# EasyEDA Pro project ProPrj_Modular Robot_2025-12-08.epro

# Schematic Schematic1
Board Name: Board1; Create Date: 2025-11-24; Page Name: P1; Project Name: Modular Robot; Schematic Name: Schematic1; Update Date: 2025-12-05; Company: EasyEDA.com; Page Size: A4; Version: V1.0
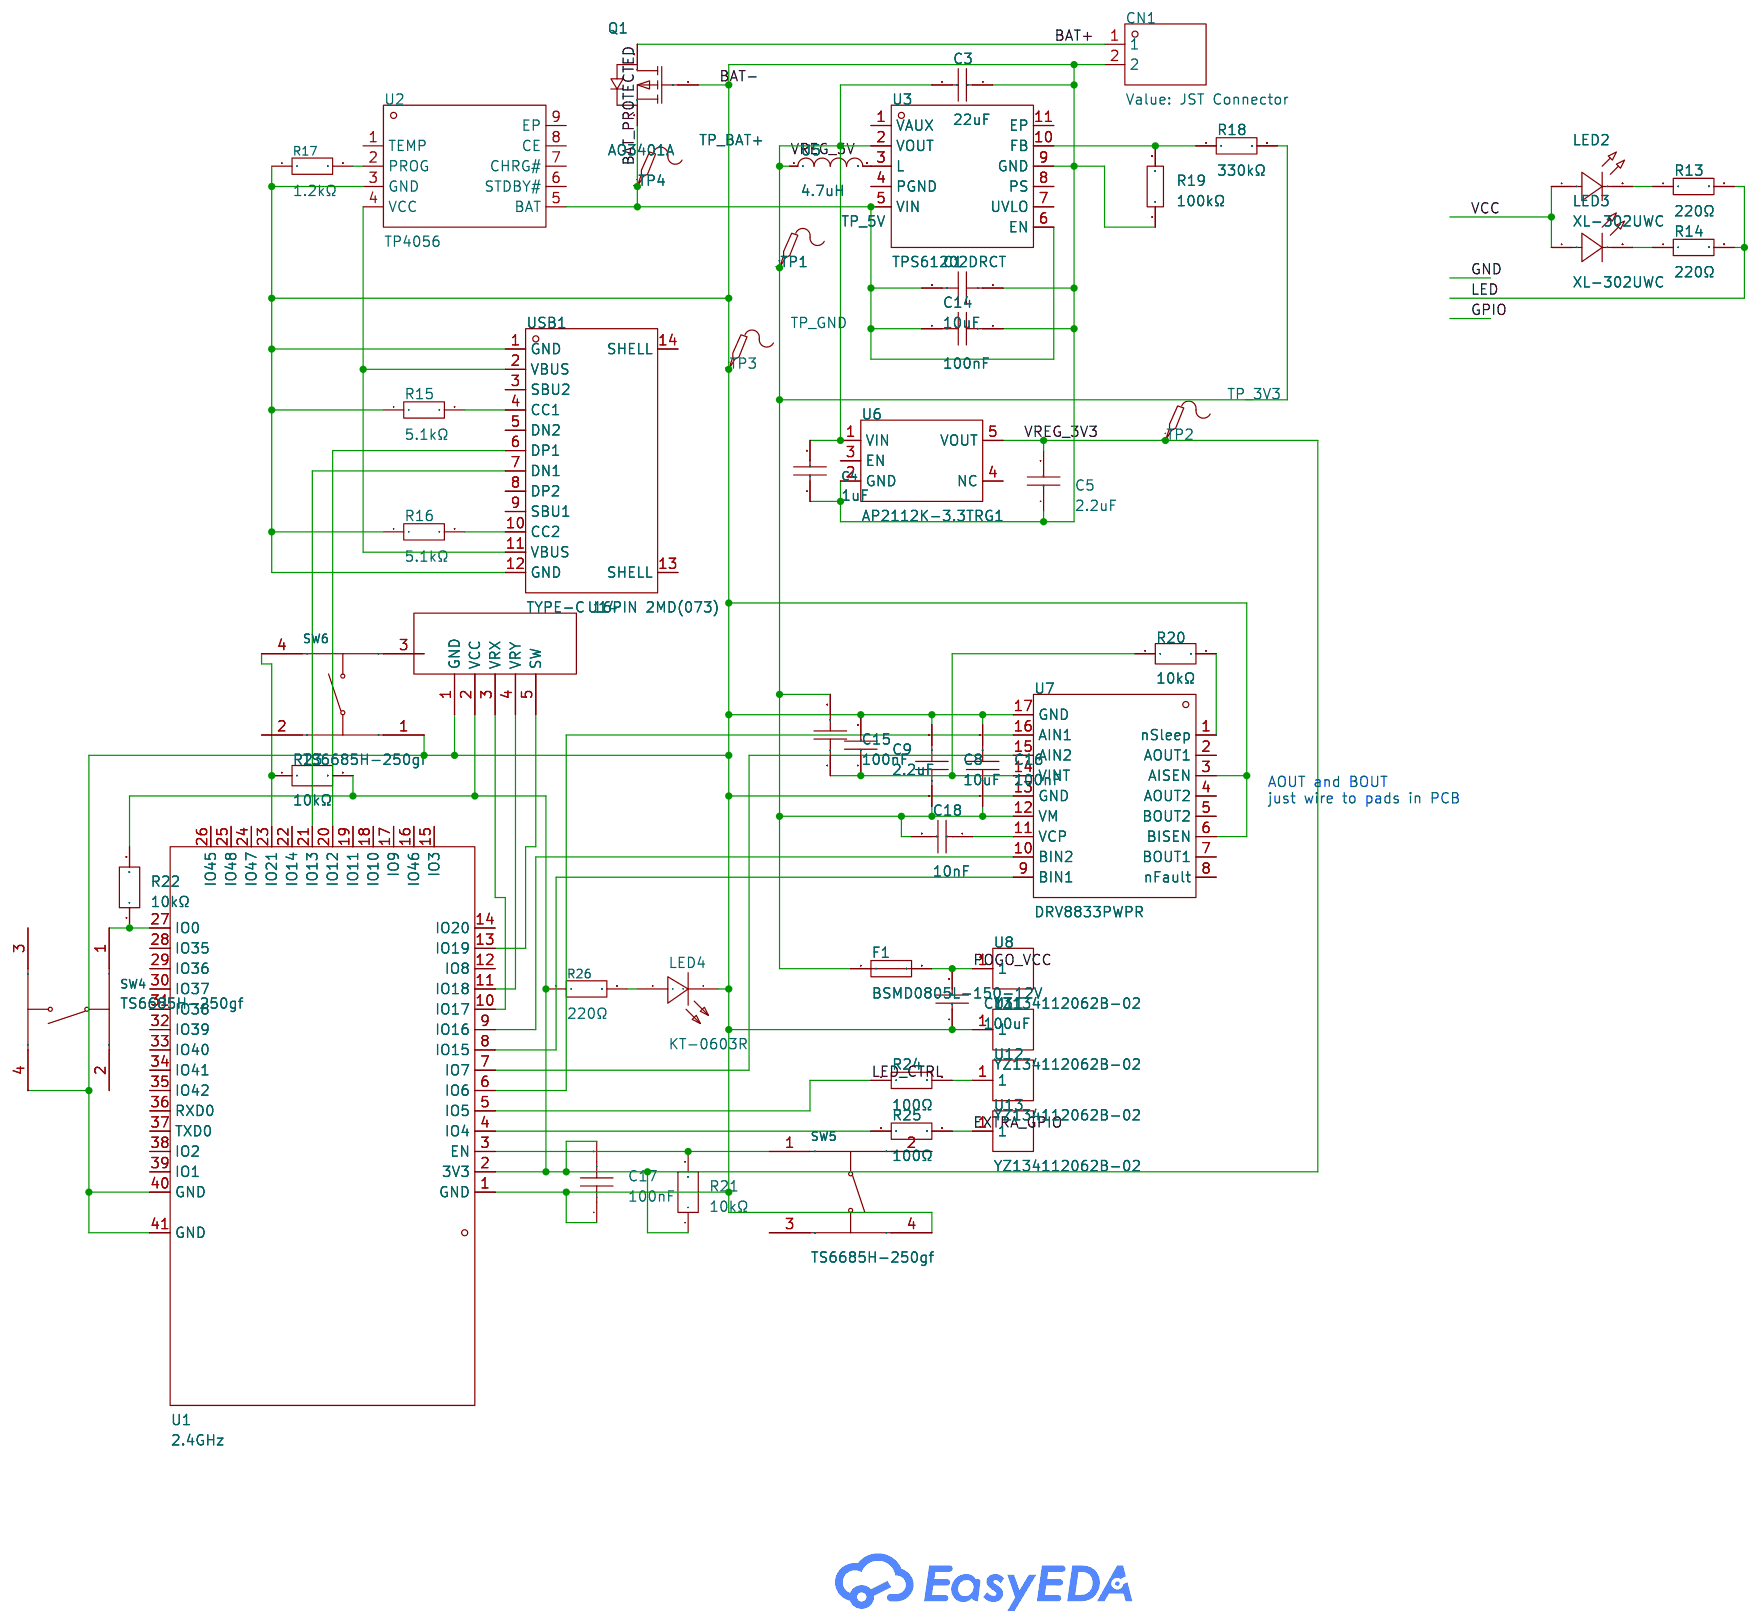
[diagram p0: schematic sheet]

## Parts
C1  10uF  [C0805]
C3  22uF  [C1206]
C4  1uF  [C0805]
C5  2.2uF  [C0603]
C8  10uF  [C0805]
C9  2.2uF  [C0603]
C13  100uF  [C1206]
C14  100nF  [C0402]
C15  100nF  [C0402]
C16  100nF  [C0402]
C17  100nF  [C0402]
C18  10nF  [C0805]
CN1  JST Connector  [CONN-TH_B2B-XH-A-LF-SN]
F1  BSMD0805L-150-12V  [F0805]
LED2  XL-302UWC  [LED-TH_BD3.8-P2.54-FD_WHITE]
LED3  XL-302UWC  [LED-TH_BD3.8-P2.54-FD_WHITE]
LED4  KT-0603R  [LED0603-RD]
Q1  AO3401A  [SOT-23_L2.9-W1.3-P1.90-LS2.4-BR]
R13  220Ω  [R0603]
R14  220Ω  [R0603]
R15  5.1kΩ  [R0603]
R16  5.1kΩ  [R0603]
R17  1.2kΩ  [R0603]
R18  330kΩ  [R0603]
R19  100kΩ  [R1206]
R20  10kΩ  [R0805]
R21  10kΩ  [R0805]
R22  10kΩ  [R0805]
R23  10kΩ  [R0805]
R24  100Ω  [R0805]
R25  100Ω  [R0805]
R26  220Ω  [R0805]
SW4  TS6685H-250gf  [SW-TH_4P-L6.0-W6.0-P4.50-LS6.5]
SW5  TS6685H-250gf  [SW-TH_4P-L6.0-W6.0-P4.50-LS6.5]
SW6  TS6685H-250gf  [SW-TH_4P-L6.0-W6.0-P4.50-LS6.5]
TP1  TP_5V  [Test-Point-0.5mm]
TP2  TP_3V3  [Test-Point-0.5mm]
TP3  TP_GND  [Test-Point-0.5mm]
TP4  TP_BAT+  [Test-Point-0.5mm]
U1  2.4GHz  [WIRELM-SMD_ESP32-S3-WROOM-1]
U2  TP4056  [ESOP-8_L4.9-W3.9-P1.27-LS6.0-BL-EP]
U3  TPS61202DRCT  [VSON-10_L3.0-W3.0-P0.50-TL-EP]
U5  4.7uH  [IND-SMD_L4.4-W4.2]
U6  AP2112K-3.3TRG1  [SOT-23-5_L2.9-W1.6-P0.95-LS2.8-BR]
U7  DRV8833PWPR  [TSSOP-16_L5.0-W4.4-P0.65-LS6.4-BL-EP]
U8  YZ134112062B-02  [TESTPOINT-TH_YZ134112062B-02]
U11  YZ134112062B-02  [TESTPOINT-TH_YZ134112062B-02]
U12  YZ134112062B-02  [TESTPOINT-TH_YZ134112062B-02]
U13  YZ134112062B-02  [TESTPOINT-TH_YZ134112062B-02]
U14  -  [ARDUINO JOYSTICK KY-023]
USB1  TYPE-C 16PIN 2MD(073)  [USB-C-SMD_TYPE-C-6PIN-2MD-073]

## Library data of the parts
C1 C8 = CL21A106KAYNNNE_C15850: Capacitance:10uF Tolerance:±10% Tolerance:±10% Voltage Rating:25V Temperature Coefficient:X5R; LCSC Part Name: 10uF ±10% 25V; Supplier Part: C15850; Manufacturer: SAMSUNG(三星); Manufacturer Part: CL21A106KAYNNNE; Supplier Footprint: 0805; JLCPCB Part Class: Basic Part; Datasheet: https://item.szlcsc.com/datasheet/CL21A106KAYNNNE/16532.html; Supplier: LCSC; Tolerance: ±10%; Voltage Rating: 25V; Temperature Coefficient: X5R
C3 = CL31A226KAHNNNE: Capacitance:22uF Tolerance:±10% Tolerance:±10% Voltage Rating:25V Temperature Coefficient:X5R; LCSC Part Name: 22uF ±10% 25V; Supplier Part: C12891; Manufacturer: SAMSUNG(三星); Supplier Footprint: 1206; JLCPCB Part Class: Basic Part; Datasheet: https://item.szlcsc.com/datasheet/CL31A226KAHNNNE/13537.html; Supplier: LCSC; Tolerance: ±10%; Voltage Rating: 25V; Temperature Coefficient: X5R
C4 = CL21B105KBFNNNE: Capacitance:1uF Tolerance:±10% Tolerance:±10% Voltage Rating:50V Temperature Coefficient:X7R; LCSC Part Name: 1uF ±10% 50V; Supplier Part: C28323; Manufacturer: SAMSUNG(三星); Supplier Footprint: 0805; JLCPCB Part Class: Basic Part; Datasheet: https://item.szlcsc.com/datasheet/CL21B105KBFNNNE/29074.html; Supplier: LCSC; Tolerance: ±10%; Voltage Rating: 50V; Temperature Coefficient: X7R
C5 C9 = CL10A225KO8NNNC: Capacitance:2.2uF Tolerance:±10% Tolerance:±10% Voltage Rating:16V Temperature Coefficient:X5R; LCSC Part Name: 2.2uF ±10% 16V; Supplier Part: C23630; Manufacturer: SAMSUNG(三星); Supplier Footprint: 0603; JLCPCB Part Class: Basic Part; Datasheet: https://item.szlcsc.com/datasheet/CL10A225KO8NNNC/24366.html; Supplier: LCSC; Tolerance: ±10%; Voltage Rating: 16V; Temperature Coefficient: X5R
C13 = CL31A107MQHNNNE: Capacitance:100uF Tolerance:±20% Tolerance:±20% Voltage Rating:6.3V Temperature Coefficient:X5R; LCSC Part Name: 100uF ±20% 6.3V; Supplier Part: C15008; Manufacturer: SAMSUNG(三星); Supplier Footprint: 1206; JLCPCB Part Class: Basic Part; Datasheet: https://item.szlcsc.com/datasheet/CL31A107MQHNNNE/15681.html; Supplier: LCSC; Tolerance: ±20%; Voltage Rating: 6.3V; Temperature Coefficient: X5R
C14-C17 = CL05B104KO5NNNC: Capacitance:100nF Tolerance:±10% Tolerance:±10% Voltage Rating:16V Temperature Coefficient:X7R; LCSC Part Name: 100nF ±10% 16V; Supplier Part: C1525; Manufacturer: SAMSUNG(三星); Supplier Footprint: 0402; JLCPCB Part Class: Basic Part; Datasheet: https://item.szlcsc.com/datasheet/CL05B104KO5NNNC/1877.html; Supplier: LCSC; Tolerance: ±10%; Voltage Rating: 16V; Temperature Coefficient: X7R
C18 = CL21B103KBANNNC: Capacitance:10nF Tolerance:±10% Tolerance:±10% Voltage Rating:50V Temperature Coefficient:X7R; LCSC Part Name: 10nF ±10% 50V; Supplier Part: C1710; Manufacturer: SAMSUNG(三星); Supplier Footprint: 0805; JLCPCB Part Class: Basic Part; Datasheet: https://item.szlcsc.com/datasheet/CL21B103KBANNNC/2062.html; Supplier: LCSC; Tolerance: ±10%; Voltage Rating: 50V; Temperature Coefficient: X7R
CN1 = B2B-XH-A(LF)(SN): Pins Structure:1x2P Pitch:2.5mm Mounting Type:Through Hole Reference Series:XH Number of Pins:2P Number of Rows:1 Number of PINs Per Row:2 Row Spacing:- Current Rating:3A Contact Material:Brass Contact Plating:Tin Operating Temperature:-25℃~+85℃ Operating; LCSC Part Name: 1x2P 间距:2.5mm 直插 系列:XH; Supplier Part: C158012; Manufacturer: JST; Supplier Footprint: 插件,P=2.5mm; JLCPCB Part Class: Extended Part; Datasheet: https://item.szlcsc.com/datasheet/B2B-XH-A(LF)(SN)/169360.html; Supplier: LCSC; Pins Structure: 1x2P; Pitch: 2.5mm; Mounting Type: Through Hole; Reference Series: XH; Number of Pins: 2P; Number of Rows: 1; Number of PINs Per Row: 2; Current Rating: 3A; Contact Material: Brass; Contact Plating: Tin; Operating Temperature: -25℃~+85℃; Voltage Rating: 250V; Plastic Material: PA66; Flame Retardant Rating: UL94V-0; Supplementary Features: K Pin; Color: White; Z-Height of the Board: 7mm; X-Length of Bottom Edge on Board (Spacing Line): 7.4mm; Y-Width of Bottom Edge on Board: 5.75mm
F1 = BSMD0805L-150-12V: Voltage - Max:12V Current - Max:50A Hold Current:1.5A Trip Current:3A Power Dissipation:1.2W Resistance - Initial (Ri) (Min):8mΩ Resistance - Post Trip (R1) (Max):60mΩ Time to Trip(Max):5s Operating Temperature:- Operating Temperature:-; LCSC Part Name: 0805 1.5A 12V 低阻涂胶封边; Supplier Part: C48782916; Manufacturer: BHFUSE(佰宏); Supplier Footprint: 0805; JLCPCB Part Class: Extended Part; Datasheet: https://item.szlcsc.com/datasheet/BSMD0805L-150-12V/51079588.html; Supplier: LCSC; Voltage - Max: 12V; Current - Max: 50A; Hold Current: 1.5A; Trip Current: 3A; Power Dissipation: 1.2W; Resistance - Initial (Ri) (Min): 8mΩ; Resistance - Post Trip (R1) (Max): 60mΩ; Time to Trip(Max): 5s
LED2 LED3 = XL-302UWC: Lamp Holder Type:3mm Round Lens Illumination Color:White Voltage - Forward(Vf):3.2V Voltage - Forward(Vf):3.2V Power(Watts):70mW Forward Current:20mA Lens Color:Water Clear Color Temperature:6000K~8000K Color Temperature:6000K~8000K Luminous Intensity:800; LCSC Part Name: 白发白短脚发光器件; Supplier Part: C2895458; Manufacturer: XINGLIGHT(成兴光); Supplier Footprint: 插件,D=3mm; JLCPCB Part Class: Extended Part; Datasheet: https://atta.szlcsc.com/upload/public/pdf/source/20250716/2CD7D6C127B884119A4550035EC69AE5.pdf; Supplier: LCSC; Lamp Holder Type: 3mm Round Lens; Illumination Color: White; Voltage - Forward(Vf): 3.2V; Power(Watts): 70mW; Forward Current: 20mA; Lens Color: Water Clear; Color Temperature: 6000K~8000K; Luminous Intensity: 8000mcd; Viewing Angle: 30°; Operating Temperature: -20℃~+85℃
LED4 = KT-0603R: Emitted Color:Red Power Dissipation:- Forward Current:- Dominant Wavelength:- Dominant Wavelength:- Peak Wavelength:- Diode Configuration:- Lens Color:- Color Temperature:- Color Temperature:- Viewing Angle:- Mounting Sytle:- Operating Temperature:-40℃~+8; LCSC Part Name: 0603 红灯 高亮; Supplier Part: C2286; Manufacturer: KENTO; Supplier Footprint: 0603; JLCPCB Part Class: Basic Part; Datasheet: https://atta.szlcsc.com/upload/public/pdf/source/20160616/1466072038404.pdf; Supplier: LCSC; Emitted Color: Red; Operating Temperature: -40℃~+85℃
Q1 = AO3401A_C15127: Number:1 P-Channel Drain to Source Voltage:30V Current - Continuous Drain(Id):4A RDS(on):47mΩ@10V；85mΩ@2.5V；60mΩ@4.5V Pd - Power Dissipation:- Gate Threshold Voltage (Vgs(th)):900mV@250uA Gate Charge(Qg):14nC@10V Input Capacitance(Ciss):645pF Reverse Tran; LCSC Part Name: 1个P沟道 耐压:30V 电流:4A; Supplier Part: C15127; Manufacturer: AOS; Supplier Footprint: SOT-23; JLCPCB Part Class: Basic Part; Datasheet: https://item.szlcsc.com/datasheet/AO3401A/15801.html; Supplier: LCSC; Number: 1 P-Channel; Drain to Source Voltage: 30V; Current - Continuous Drain(Id): 4A; RDS(on): 47mΩ@10V；85mΩ@2.5V；60mΩ@4.5V; Gate Threshold Voltage (Vgs(th)): 900mV@250uA; Gate Charge(Qg): 14nC@10V; Input Capacitance(Ciss): 645pF; Reverse Transfer Capacitance (Crss@Vds): 55pF; Output Capacitance(Coss): 80pF
R13 R14 = RC0603FR-07220RL: Type:Thick Film Resistor Resistance:220Ω Tolerance:±1% Tolerance:±1% Power(Watts):100mW Voltage-Supply(Max):75V Temperature Coefficient:±100ppm/℃ Temperature Coefficient:±100ppm/℃ Operating Temperature:-55℃~+155℃ Operating Temperature:-55℃~+155℃; LCSC Part Name: 厚膜电阻 220Ω ±1% 100mW; Supplier Part: C107696; Manufacturer: YAGEO(国巨); Supplier Footprint: 0603; JLCPCB Part Class: Extended Part; Datasheet: https://item.szlcsc.com/datasheet/RC0603FR-07220RL/108915.html; Supplier: LCSC; Type: Thick Film Resistor; Tolerance: ±1%; Power(Watts): 100mW; Voltage-Supply(Max): 75V; Temperature Coefficient: ±100ppm/℃; Operating Temperature: -55℃~+155℃
R15 R16 = 0603WAF5101T5E: Type:Thick Film Resistor Resistance:5.1kΩ Tolerance:±1% Tolerance:±1% Power(Watts):100mW Voltage-Supply(Max):75V Temperature Coefficient:±100ppm/℃ Temperature Coefficient:±100ppm/℃ Operating Temperature:-55℃~+155℃ Operating Temperature:-55℃~+155℃; LCSC Part Name: 5.1kΩ ±1% 100mW 厚膜电阻; Supplier Part: C23186; Manufacturer: UNI-ROYAL(厚声); Supplier Footprint: 0603; JLCPCB Part Class: Basic Part; Datasheet: https://item.szlcsc.com/datasheet/0603WAF5101T5E/23913.html; Supplier: LCSC; Type: Thick Film Resistor; Tolerance: ±1%; Power(Watts): 100mW; Voltage-Supply(Max): 75V; Temperature Coefficient: ±100ppm/℃; Operating Temperature: -55℃~+155℃
R17 = 0603WAF1201T5E: Type:Thick Film Resistor Resistance:1.2kΩ Tolerance:±1% Tolerance:±1% Power(Watts):100mW Voltage-Supply(Max):75V Temperature Coefficient:±100ppm/℃ Temperature Coefficient:±100ppm/℃ Operating Temperature:-55℃~+155℃ Operating Temperature:-55℃~+155℃; LCSC Part Name: 1.2kΩ ±1% 100mW 厚膜电阻; Supplier Part: C22765; Manufacturer: UNI-ROYAL(厚声); Supplier Footprint: 0603; JLCPCB Part Class: Basic Part; Datasheet: https://item.szlcsc.com/datasheet/0603WAF1201T5E/23492.html; Supplier: LCSC; Type: Thick Film Resistor; Tolerance: ±1%; Power(Watts): 100mW; Voltage-Supply(Max): 75V; Temperature Coefficient: ±100ppm/℃; Operating Temperature: -55℃~+155℃
R18 = 0603WAF3303T5E: Type:Thick Film Resistors Resistance:330kΩ Tolerance:±1% Tolerance:±1% Power(Watts): Overload Voltage (Max): Temperature Coefficient:±100ppm/℃ Temperature Coefficient:±100ppm/℃ Operating Temperature Range:-55℃~+155℃ Operating Temperature Range:-55℃~+155℃; LCSC Part Name: 330kΩ ±1% 100mW 厚膜电阻; Supplier Part: C23137; Manufacturer: UNI-ROYAL(厚声); Supplier Footprint: 0603; JLCPCB Part Class: Basic Part; Datasheet: https://atta.szlcsc.com/upload/public/pdf/source/20200306/C422600_1E6D84923E4A46A82E41ADD87F860B5C.pdf; Supplier: LCSC; Type: Thick Film Resistors; Tolerance: ±1%; Temperature Coefficient: ±100ppm/℃; Operating Temperature Range: -55℃~+155℃
R19 = 1206W4F1003T5E: Type:Thick Film Resistor Resistance:100kΩ Tolerance:±1% Tolerance:±1% Power(Watts):250mW Voltage-Supply(Max):200V Temperature Coefficient:±100ppm/℃ Temperature Coefficient:±100ppm/℃ Operating Temperature:-55℃~+155℃ Operating Temperature:-55℃~+155℃; LCSC Part Name: 100kΩ ±1% 250mW 厚膜电阻; Supplier Part: C17900; Manufacturer: UNI-ROYAL(厚声); Supplier Footprint: 1206; JLCPCB Part Class: Basic Part; Datasheet: https://item.szlcsc.com/datasheet/1206W4F1003T5E/18588.html; Supplier: LCSC; Type: Thick Film Resistor; Tolerance: ±1%; Power(Watts): 250mW; Voltage-Supply(Max): 200V; Temperature Coefficient: ±100ppm/℃; Operating Temperature: -55℃~+155℃
R20-R23 = 0805W8F1002T5E_C38522: Type:Thick Film Resistor Resistance:10kΩ Tolerance:±1% Tolerance:±1% Power(Watts):125mW Voltage-Supply(Max):150V Temperature Coefficient:±100ppm/℃ Temperature Coefficient:±100ppm/℃ Operating Temperature:-55℃~+155℃ Operating Temperature:-55℃~+155℃; LCSC Part Name: 10kΩ ±1% 125mW 厚膜电阻; Supplier Part: C38522; Manufacturer: UNI-ROYAL(厚声); Manufacturer Part: 0805W8F1002T5E; Supplier Footprint: 0805; JLCPCB Part Class: Extended Part; Datasheet: https://item.szlcsc.com/datasheet/0805W8F1002T5E/39505.html; Supplier: LCSC; Type: Thick Film Resistor; Tolerance: ±1%; Power(Watts): 125mW; Voltage-Supply(Max): 150V; Temperature Coefficient: ±100ppm/℃; Operating Temperature: -55℃~+155℃
R24 R25 = 0805W8F1000T5E_C17408: Type:Thick Film Resistors Resistance: Tolerance:±1% Tolerance:±1% Power(Watts): Overload Voltage (Max): Temperature Coefficient:±100ppm/℃ Temperature Coefficient:±100ppm/℃ Operating Temperature Range:-55℃~+155℃ Operating Temperature Range:-55℃~+155℃; LCSC Part Name: 100Ω ±1% 125mW 厚膜电阻; Supplier Part: C17408; Manufacturer: UNI-ROYAL(厚声); Manufacturer Part: 0805W8F1000T5E; Supplier Footprint: 0805; JLCPCB Part Class: Basic Part; Datasheet: https://atta.szlcsc.com/upload/public/pdf/source/20200306/C422600_1E6D84923E4A46A82E41ADD87F860B5C.pdf; Supplier: LCSC; Type: Thick Film Resistors; Tolerance: ±1%; Temperature Coefficient: ±100ppm/℃; Operating Temperature Range: -55℃~+155℃
R26 = 0805W8F2200T5E: Type:Thick Film Resistor Resistance:220Ω Tolerance:±1% Tolerance:±1% Power(Watts):125mW Voltage-Supply(Max):150V Temperature Coefficient:±100ppm/℃ Temperature Coefficient:±100ppm/℃ Operating Temperature:-55℃~+155℃ Operating Temperature:-55℃~+155℃; LCSC Part Name: 220Ω ±1% 125mW 厚膜电阻; Supplier Part: C17557; Manufacturer: UNI-ROYAL(厚声); Supplier Footprint: 0805; JLCPCB Part Class: Basic Part; Datasheet: https://item.szlcsc.com/datasheet/0805W8F2200T5E/18245.html; Supplier: LCSC; Type: Thick Film Resistor; Tolerance: ±1%; Power(Watts): 125mW; Voltage-Supply(Max): 150V; Temperature Coefficient: ±100ppm/℃; Operating Temperature: -55℃~+155℃
SW4-SW6 = TS6685H-250gf: Circuit:SPST Actuator Style:Round Button Operating Force:2.5N Mounting Type:Through Hole Length:6mm Width:6mm Switch Height:8.5mm Contact Current:50mA Voltage Rating:12V With Lamp:- Life:-; LCSC Part Name: 6*6*8.5mm 直插 轻触开关; Supplier Part: C13828; Manufacturer: YE; Supplier Footprint: 插件; JLCPCB Part Class: Extended Part; Datasheet: https://item.szlcsc.com/datasheet/TS6685H-250gf/14483.html; Supplier: LCSC; Circuit: SPST; Actuator Style: Round Button; Operating Force: 2.5N; Mounting Type: Through Hole; Length: 6mm; Width: 6mm; Switch Height: 8.5mm; Contact Current: 50mA; Voltage Rating: 12V
TP1-TP4 = Test-Point: Test Point 测试点
U1 = ESP32-S3-WROOM-1-N8R2: Utilized IC / Part:ESP32-S3 Chip Interface Type:SPI；I2S；USB；I2C；UART Frequency:2.4GHz; LCSC Part Name: 通用型Wi-Fi+低功耗蓝牙MCU模组; Supplier Part: C2913204; Manufacturer: ESPRESSIF(乐鑫); Supplier Footprint: SMD,25.5x18mm; JLCPCB Part Class: Extended Part; Datasheet: https://item.szlcsc.com/datasheet/ESP32-S3-WROOM-1-N8R2/3198302.html; Supplier: LCSC; Utilized IC / Part: ESP32-S3 Chip; Interface Type: SPI；I2S；USB；I2C；UART
U2 = TP4056_C382139: The Chip Type:- Voltage - Supply:4V~6V Voltage - Supply:4V~6V Charge Current - Max:- Charging Saturation Voltage:4.2V Type of Battery:Lithium-ion/Polymer Number of Cells:1 Number of Cells:1 Operating Temperature:-40℃~+85℃ Operating Temperature:-40℃~+85℃; LCSC Part Name: 1A锂电池充电IC; Supplier Part: C382139; Manufacturer: TPOWER(天源); Supplier Footprint: ESOP-8; JLCPCB Part Class: Extended Part; Datasheet: https://item.szlcsc.com/datasheet/TP4056/354934.html; Supplier: LCSC; Voltage - Supply: 4V~6V; Charging Saturation Voltage: 4.2V; Type of Battery: Lithium-ion/Polymer; Number of Cells: 1; Operating Temperature: -40℃~+85℃
U3 = TPS61202DRCT: Function:Boost type Output Type:Fixed Voltage - Supply:300mV~5.5V Voltage - Supply:300mV~5.5V Output Voltage:5V Output Voltage:5V Output Current:- Frequency - Switching:1.65MHz Frequency - Switching:1.65MHz Operating Temperature:-40℃~+85℃@(TA) Operating T; LCSC Part Name: 低输入电压同步升压转换器; Supplier Part: C2070658; Manufacturer: TI(德州仪器); Supplier Footprint: VSON-10-EP(3x3); JLCPCB Part Class: Extended Part; Datasheet: https://www.ti.com/cn/lit/gpn/tps61202; Supplier: LCSC; Function: Boost type; Output Type: Fixed; Voltage - Supply: 300mV~5.5V; Output Voltage: 5V; Frequency - Switching: 1.65MHz; Operating Temperature: -40℃~+85℃@(TA); Synchronous Rectifier: Yes; Number of Outputs: 1; Topology: Boost; Switch tube (built-in/external): Built-in
U5 = APH0420T4R7M: Inductance:4.7uH Tolerance:±20% Tolerance:±20% Current Rating:2.8A Current - Saturation(Isat):3A DC Resistance(DCR):105mΩ Type:Molded Inductor Ratings:-; LCSC Part Name: 4.7uH ±20% 3A; Supplier Part: C5349668; Manufacturer: APV(爱普微); Supplier Footprint: SMD,4.4x4.2mm; JLCPCB Part Class: Extended Part; Datasheet: https://item.szlcsc.com/datasheet/APH0420T4R7M/6135083.html; Supplier: LCSC; Tolerance: ±20%; Current Rating: 2.8A; Current - Saturation(Isat): 3A; DC Resistance(DCR): 105mΩ; Type: Molded Inductor
U6 = AP2112K-3.3TRG1_C23380830: Output Type:Fixed Voltage - Supply:5.5V Output Voltage:3.3V Output Voltage:3.3V Output Current:600mA Power Supply Rejection Ratio (PSRR):75dB@(1kHz) Voltage Dropout:320mV@(600mA) standby current:10uA Features:Over Temperature Protection Operating Temperat; LCSC Part Name: 集成电路; Supplier Part: C23380830; Manufacturer: TECH PUBLIC(台舟); Supplier Footprint: SOT-23-5; JLCPCB Part Class: Extended Part; Datasheet: https://item.szlcsc.com/datasheet/AP2112K-3.3TRG1/25111500.html; Supplier: LCSC; Output Type: Fixed; Voltage - Supply: 5.5V; Output Voltage: 3.3V; Output Current: 600mA; Power Supply Rejection Ratio (PSRR): 75dB@(1kHz); Voltage Dropout: 320mV@(600mA); standby current: 10uA; Features: Over Temperature Protection; Operating Temperature: -40℃~+85℃@(Ta); Output Configuration: Positive
U7 = DRV8833PWPR: Technology:Yes Operating Temperature:-40℃~+85℃ Operating Temperature:-40℃~+85℃; LCSC Part Name: 1.5A 有刷直流电机驱动芯片 10.8V; Supplier Part: C50506; Manufacturer: TI(德州仪器); Supplier Footprint: TSSOP-16-EP; JLCPCB Part Class: Extended Part; Datasheet: https://www.ti.com/cn/lit/gpn/drv8833; Supplier: LCSC; Technology: Yes; Operating Temperature: -40℃~+85℃
U8 U11-U13 = YZ134112062B-02: Type:Pogo Pin Number of Pins:1P Overall Length/Height:6.2mm Operational Height:4.2mm Contact Resistance:50mΩ Elastic Life:10,000 Cycles Current Rating:1A Voltage Rating:12V Contact Material:Brass Contact Plating:Gold Operating Temperature:-40℃~+85℃ Operat; LCSC Part Name: POGO PIN折弯型弹簧顶针; Supplier Part: C5157493; Manufacturer: Xinyangze(鑫扬泽); JLCPCB Part Class: Extended Part; Datasheet: https://item.szlcsc.com/datasheet/YZ134112062B-02/5795611.html; Supplier: LCSC; Type: Pogo Pin; Number of Pins: 1P; Overall Length/Height: 6.2mm; Operational Height: 4.2mm; Contact Resistance: 50mΩ; Elastic Life: 10,000 Cycles; Current Rating: 1A; Voltage Rating: 12V; Contact Material: Brass; Contact Plating: Gold; Operating Temperature: -40℃~+85℃
U14 = KY-023
USB1 = TYPE-C 16PIN 2MD(073): Connector Type:Type-C Protocol Standard:- Gender:Female Mounting Type:Surface Mount, Right Angle Number of Contacts:16P Number of Ports:1 Current Rating-Power:3A Voltage Rating:5V Connect-Disconnect Life:5,000 Cycles Supplementary Features:- Center Height; LCSC Part Name: Type-C 母 卧贴; Supplier Part: C2765186; Manufacturer: SHOU HAN(首韩); Supplier Footprint: SMD; JLCPCB Part Class: Extended Part; Datasheet: https://item.szlcsc.com/datasheet/TYPE-C%252016PIN%25202MD(073)/2901843.html; Supplier: LCSC; Connector Type: Type-C; Gender: Female; Mounting Type: Surface Mount, Right Angle; Number of Contacts: 16P; Number of Ports: 1; Current Rating-Power: 3A; Voltage Rating: 5V; Connect-Disconnect Life: 5,000 Cycles; Detection color: Black; Operating Temperature: -25℃~+85℃

## Nets
VCC: LED2.1(A) LED3.1(A) U2.4(VCC) USB1.2(VBUS) USB1.11(VBUS)
BAT+: CN1.1 Q1.3(D)
BAT-: C1.1 C3.2 C4.1 C5.1 C8.1 C9.2 C13.1 C14.2 C16.2 C17.1 CN1.2 LED4.1(K) Q1.1(G) R15.1 R16.1 R17.1 R19.1 SW4.4 SW5.4 SW6.1 TP3.1 U1.1(GND) U1.40(GND) U1.41(GND) U2.3(GND) U3.9(GND) U6.2(GND) U7.3(AISEN) U7.6(BISEN) U7.13(GND) U7.17(GND) U11.1 U14.1(GND) USB1.1(GND) USB1.12(GND)
BAT_PROTECTED: C1.2 C14.1 Q1.2(S) TP4.1 U2.5(BAT) U3.5(VIN) U3.6(EN)
EXTRA_GPIO: R25.2 U13.1
LED: R13.2 R14.2
LED_CTRL: R24.1 U1.5(IO5)
POGO_VCC: C13.2 F1.2 U8.1
VREG_3V3: C5.2 C17.2 R21.1 R22.2 R23.2 R26.1 TP2.1 U1.2(3V3) U6.5(VOUT) U14.2(VCC)
VREG_5V: C3.1 C4.2 C8.2 C15.2 C16.1 C18.2 F1.1 R18.2 TP1.1 U3.2(VOUT) U5.1 U6.1(VIN) U7.12(VM)
$1N1798: R15.2 USB1.4(CC1)
$1N1835: R16.2 USB1.10(CC2)
$1N1974: U1.20(IO12) USB1.6(DP1)
$1N1982: U1.21(IO13) USB1.7(DN1)
$1N2206: U3.3(L) U5.2
$1N2258: R18.1 R19.2 U3.10(FB)
$1N6197: U1.6(IO6) U7.16(AIN1)
$1N6260: U1.7(IO7) U7.15(AIN2)
$1N6266: U1.8(IO15) U7.9(BIN1)
$1N6369: R20.2 U7.1(nSleep)
$1N6643: C9.1 C15.1 R20.1 U7.14(VINT)
$1N6818: C18.1 U7.11(VCP)
$1N8016: R24.2 U12.1
$1N8077: R25.1 U1.4(IO4)
$1N8579: R21.2 SW5.1 U1.3(EN)
$1N8766: R22.1 SW4.1 U1.27(IO0)
$1N8940: U1.9(IO16) U7.10(BIN2)
$1N9011: R23.1 SW6.4 U1.23(IO21)
$1N9325: LED4.2(A) R26.2
$1N10111: LED2.2(K) R13.1
$1N10115: LED3.2(K) R14.1
$1N10576: R17.2 U2.2(PROG)
Net-(U1-10): U1.10(IO17) U14.3(VRX)
Net-(U1-11): U1.11(IO18) U14.4(VRY)
Net-(U1-13): U1.13(IO19) U14.5(SW)

Not connected (* = marked no-connect by the designer): SW4 2 3; SW5 2 3; SW6 2 3; U1 12(IO8) 14(IO20) 15(IO3) 16(IO46) 17(IO9) 18(IO10) 19(IO11) 22(IO14) 24(IO47) 25(IO48) 26(IO45) 28(IO35) 29(IO36) 30(IO37) 31(IO38) 32(IO39) 33(IO40) 34(IO41) 35(IO42) 36(RXD0) 37(TXD0) 38(IO2) 39(IO1); U2 1(TEMP) 6(STDBY#) 7(CHRG#) 8(CE) 9(EP); U3 1(VAUX) 4(PGND) 7(UVLO) 8(PS) 11(EP); U6 3(EN) 4(NC); U7 2(AOUT1) 4(AOUT2) 5(BOUT2) 7(BOUT1) 8(nFault); USB1 3(SBU2) 5(DN2) 8(DP2) 9(SBU1) 13(SHELL) 14(SHELL)

## Notes on the sheet
- AOUT and BOUT
  just wire to pads in PCB

# Board PCB1
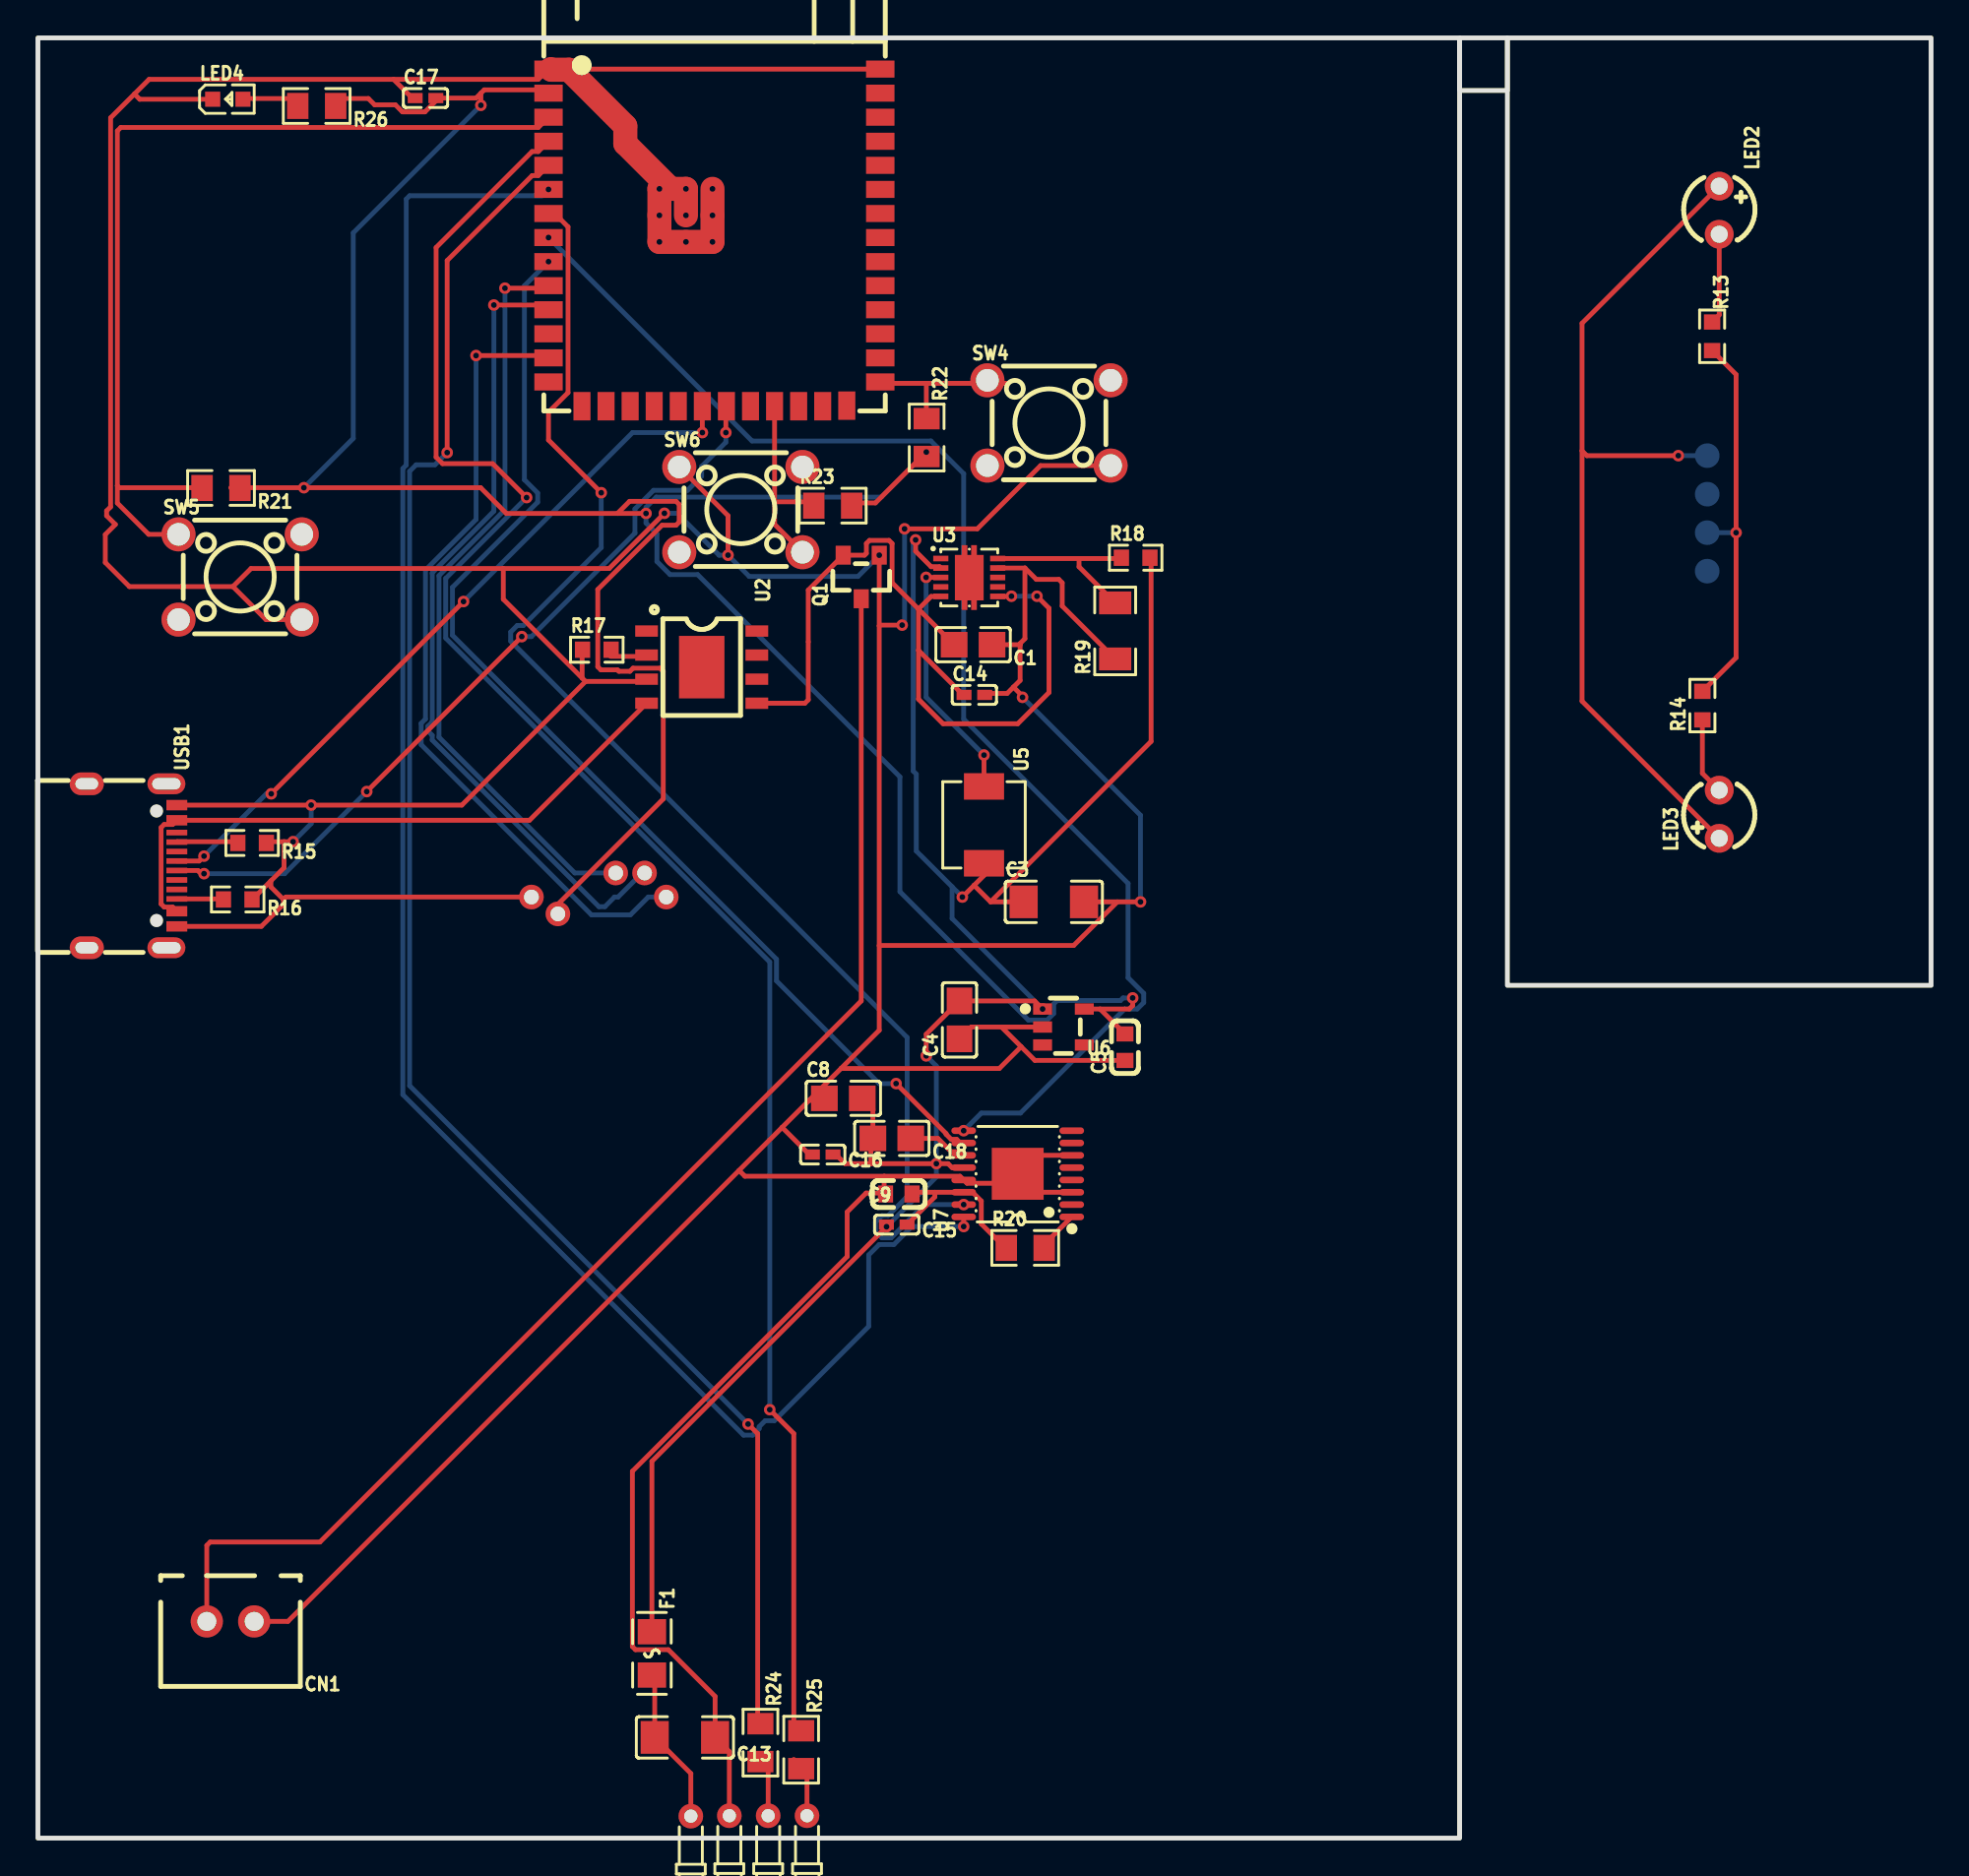
[diagram p1: board, top side]
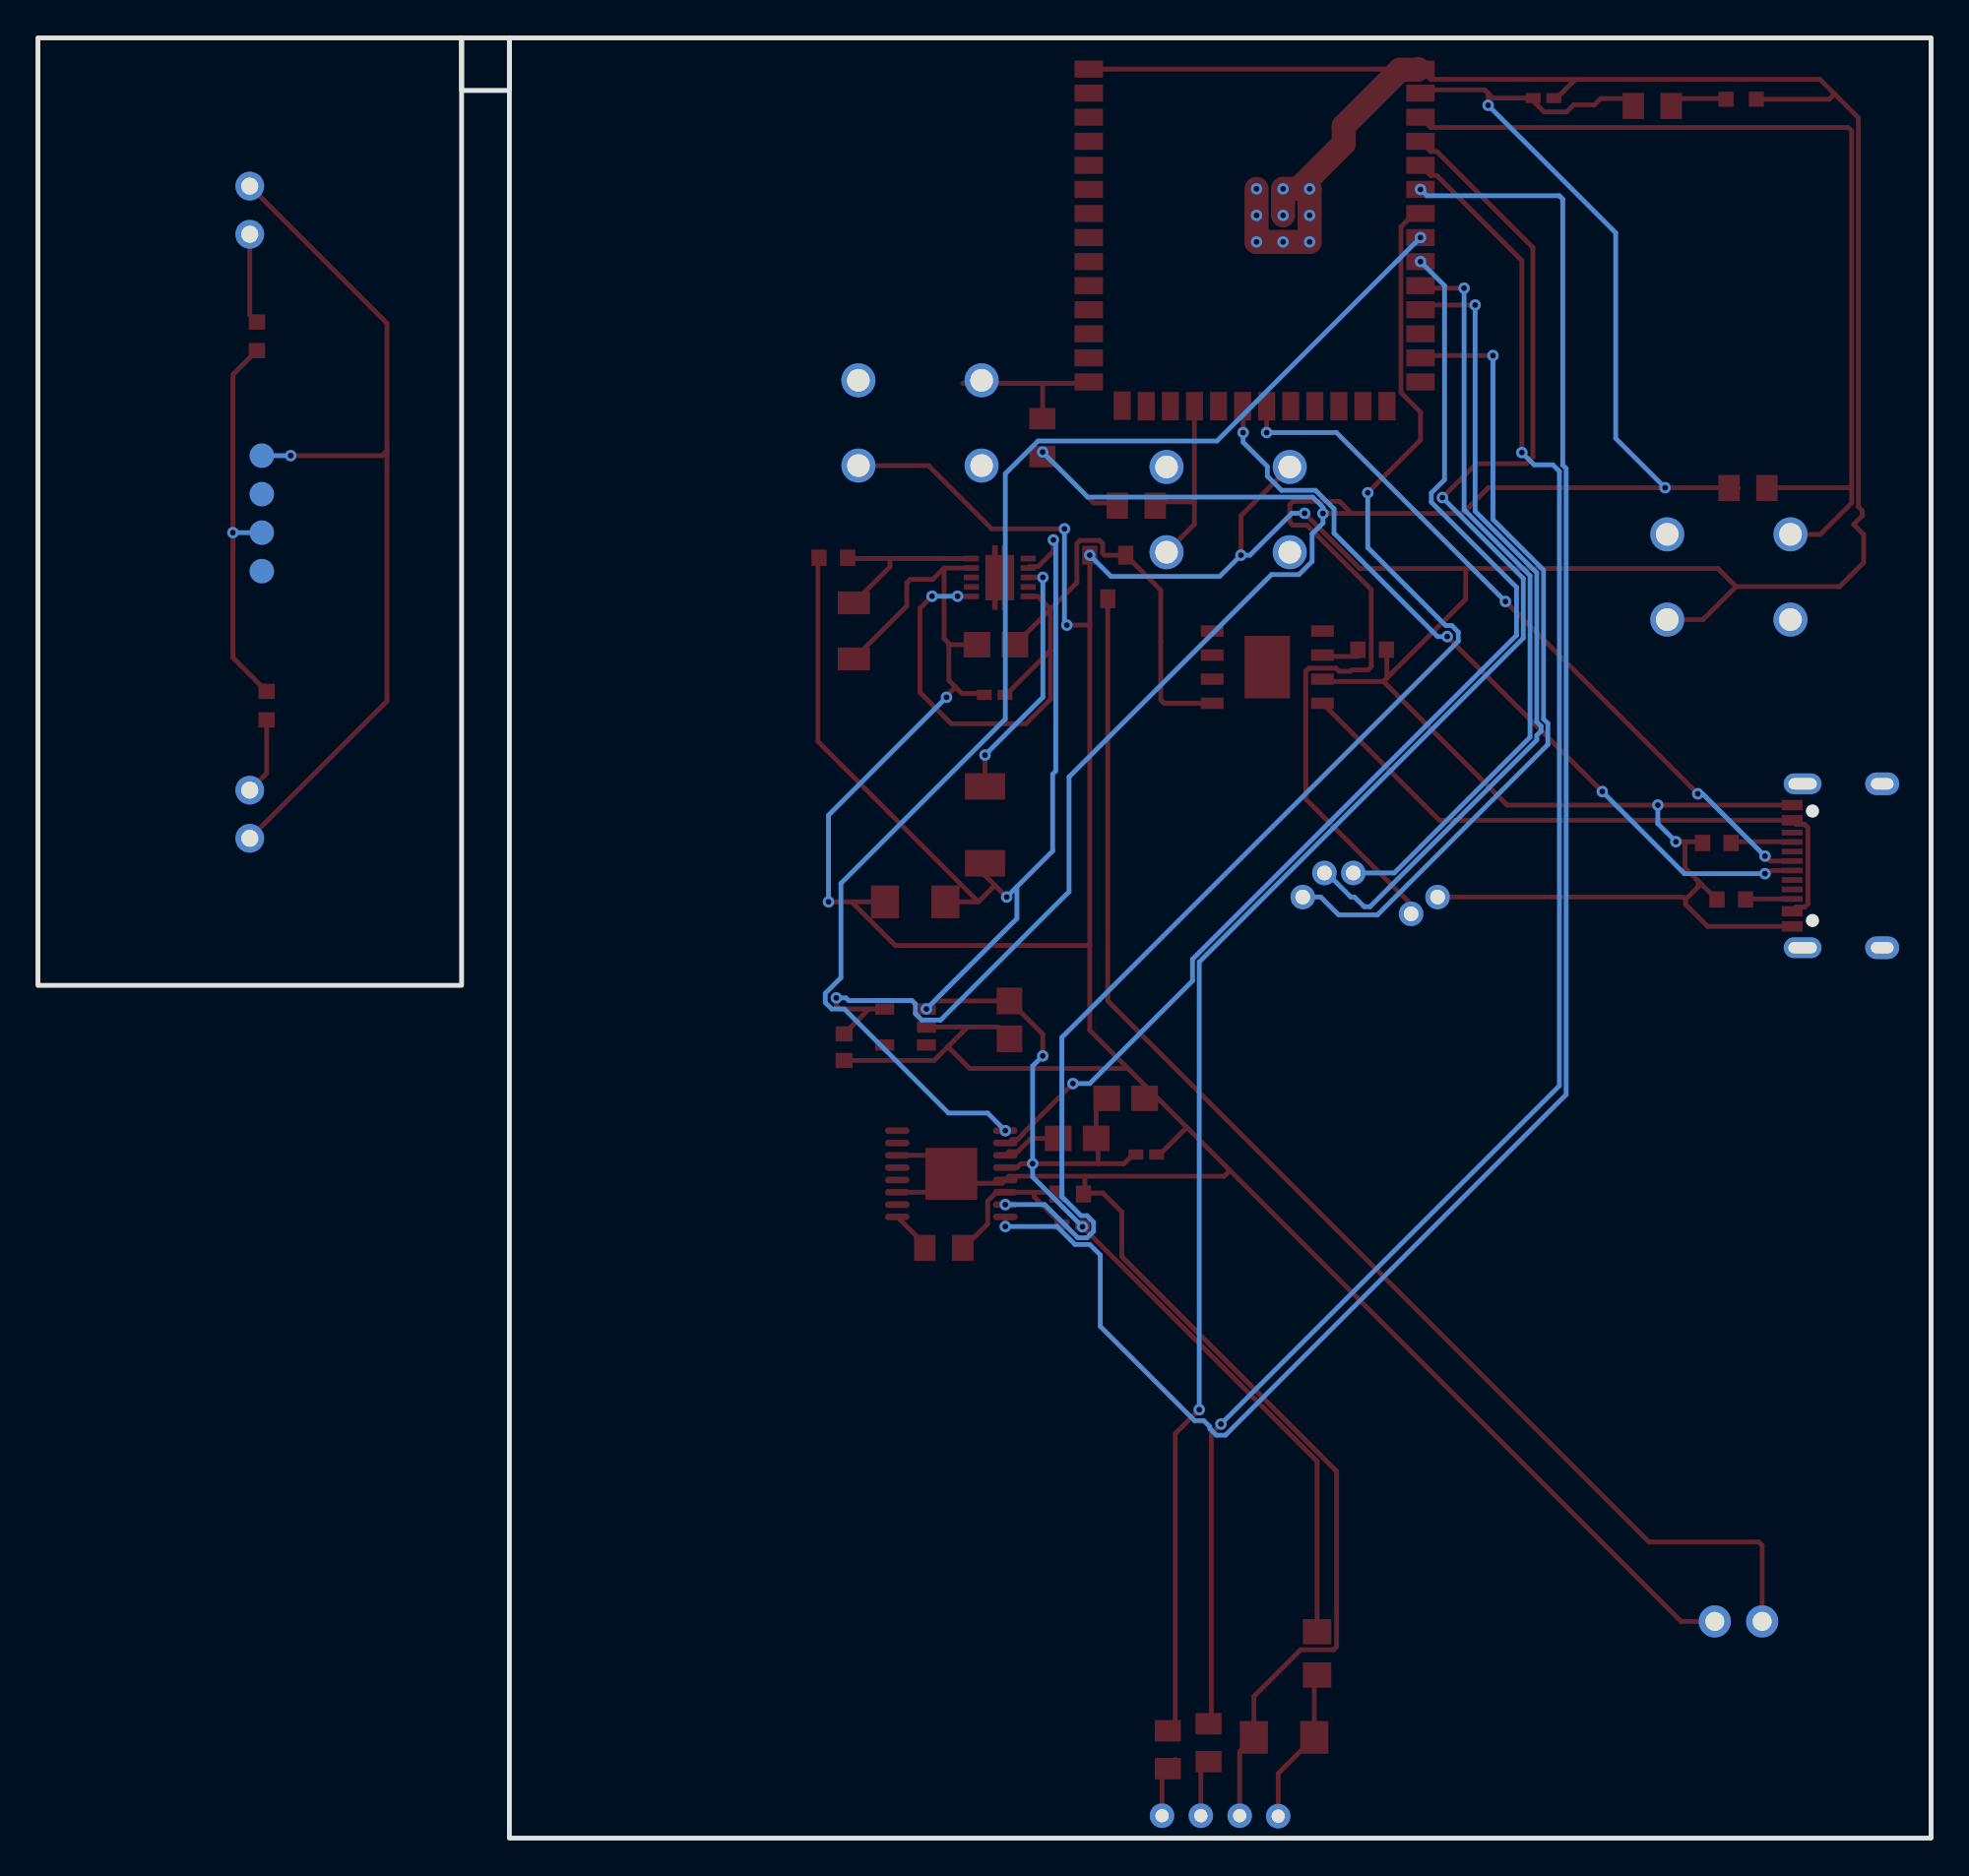
[diagram p2: board, bottom side, seen from below]

Outline 99.87 x 95 mm; copper layers: Top Layer, Bottom Layer. Coordinates in mm from the lower left corner of the outline.
Outline path: rectangle 0,95 75,0 ; rectangle 75,95 77.52,92.23 ; rectangle 99.87,95 77.52,45
Stack: Top Layer 0.035mm / Dielectric1 1.51mm FR4 er 4.5 / Bottom Layer 0.035mm

## Design rules (mm)
template: JLCPCB Capability(Two Layers Board)
spacing copperThickness1oz (default): track to track 0.102, other pairs 0.152 to 0.3
spacing copperThickness2oz: track to track 0.203, other pairs 0.152 to 0.3
track width copperThickness1oz (default): min 0.127, default 0.254, max 2.54
track width copperThickness2oz: min 0.203, default 0.254, max 2.54
differential pair differentialPair (default): width min 0.127, default 0.254, max 2.54; gap min 0.152, default 0.152
via viaSize (default): diameter min 0.5, default 0.61, max 10; hole min 0.3, default 0.305, max 6.3

## Placement (name value [footprint] x y rotation side)
C1  10uF  [C0805]  49.33 62.98 180 top
C3  22uF  [C1206]  53.59 49.41 0 top
C4  1uF  [C0805]  48.62 43.18 90 top
C5  2.2uF  [C0603]  57.35 41.74 90 top
C8  10uF  [C0805]  42.49 39.04 0 top
C9  2.2uF  [C0603]  45.42 33.99 180 top
C13  100uF  [C1206]  34.13 5.31 180 top
C14  100nF  [C0402]  49.4 60.33 0 top
C15  100nF  [C0402]  45.31 32.37 180 top
C16  100nF  [C0402]  41.4 36.07 180 top
C17  100nF  [C0402]  20.45 91.83 0 top
C18  10nF  [C0805]  45.05 36.93 180 top
CN1  JST Connector  [CONN-TH_B2B-XH-A-LF-SN]  10.16 11.44 180 top
F1  BSMD0805L-150-12V  [F0805]  32.39 9.75 270 top
LED2  XL-302UWC  [LED-TH_BD3.8-P2.54-FD_WHITE]  88.7 85.91 270 top
LED3  XL-302UWC  [LED-TH_BD3.8-P2.54-FD_WHITE]  88.7 54.03 90 top
LED4  KT-0603R  [LED0603-RD]  10.02 91.76 0 top
NOREF  -  [Pad_e522]  88.06 70.92 0 top
NOREF#2  -  [Pad_e1062]  33.15 49.66 0 top
NOREF#3  -  [Pad_e521]  88.06 72.95 0 top
NOREF#4  -  [Pad_e1063]  26.03 49.66 0 top
NOREF#5  -  [Pad_e524]  88.06 66.86 0 top
NOREF#6  -  [Pad_e1058]  27.43 48.77 0 top
NOREF#7  -  [Pad_e1061]  32 50.93 0 top
NOREF#8  -  [Pad_e523]  88.06 68.89 0 top
NOREF#9  -  [Pad_e1060]  30.48 50.93 0 top
Q1  AO3401A  [SOT-23_L2.9-W1.3-P1.90-LS2.4-BR]  43.43 66.55 90 top
R13  220Ω  [R0603]  88.32 79.25 270 top
R14  220Ω  [R0603]  87.81 59.76 90 top
R15  5.1kΩ  [R0603]  11.3 52.52 180 top
R16  5.1kΩ  [R0603]  10.54 49.54 180 top
R17  1.2kΩ  [R0603]  29.49 62.71 0 top
R18  330kΩ  [R0603]  57.91 67.57 0 top
R19  100kΩ  [R1206]  56.83 63.71 90 top
R20  10kΩ  [R0805]  52.09 31.15 0 top
R21  10kΩ  [R0805]  9.66 71.25 180 top
R22  10kΩ  [R0805]  46.88 73.91 270 top
R23  10kΩ  [R0805]  41.93 70.32 0 top
R24  100Ω  [R0805]  38.12 5.04 270 top
R25  100Ω  [R0805]  40.26 4.66 270 top
R26  220Ω  [R0805]  14.71 91.41 180 top
SW4  TS6685H-250gf  [SW-TH_4P-L6.0-W6.0-P4.50-LS6.5]  53.34 74.68 0 top
SW5  TS6685H-250gf  [SW-TH_4P-L6.0-W6.0-P4.50-LS6.5]  10.67 66.55 0 top
SW6  TS6685H-250gf  [SW-TH_4P-L6.0-W6.0-P4.50-LS6.5]  37.08 70.11 0 top
U1  2.4GHz  [WIRELM-SMD_ESP32-S3-WROOM-1]  35.69 84.46 0 top
U2  TP4056  [ESOP-8_L4.9-W3.9-P1.27-LS6.0-BL-EP]  35.02 61.8 270 top
U3  TPS61202DRCT  [VSON-10_L3.0-W3.0-P0.50-TL-EP]  49.13 66.53 0 top
U5  4.7uH  [IND-SMD_L4.4-W4.2]  49.91 53.47 270 top
U6  AP2112K-3.3TRG1  [SOT-23-5_L2.9-W1.6-P0.95-LS2.8-BR]  54.1 42.8 180 top
U7  DRV8833PWPR  [TSSOP-16_L5.0-W4.4-P0.65-LS6.4-BL-EP]  51.69 35.06 90 top
U8  YZ134112062B-02  [TESTPOINT-TH_YZ134112062B-02]  34.44 1.16 90 top
U11  YZ134112062B-02  [TESTPOINT-TH_YZ134112062B-02]  36.48 1.18 90 top
U12  YZ134112062B-02  [TESTPOINT-TH_YZ134112062B-02]  38.52 1.18 90 top
U13  YZ134112062B-02  [TESTPOINT-TH_YZ134112062B-02]  40.57 1.18 90 top
USB1  TYPE-C 16PIN 2MD(073)  [USB-C-SMD_TYPE-C-6PIN-2MD-073]  4.95 51.31 270 top

## Footprints (pads in the part's own frame, mm; a bottom-side part is the same pattern mirrored in y, then rotated)
C0402
  rect 0.79x0.54 smd: 1(-0.545,0) 2(0.545,0)
C0603
  rect 0.8x0.9 smd: 1(-0.7,0) 2(0.7,0)
C0805
  rect 1.41x1.35 smd: 1(-1,0) 2(1,0)
C1206
  rect 1.485x1.728 smd: 1(-1.593,0) 2(1.593,0)
CONN-TH_B2B-XH-A-LF-SN
  round 1.7 hole 1: 1(1.25,0) 2(-1.25,0)
ESOP-8_L4.9-W3.9-P1.27-LS6.0-BL-EP
  rect 0.6x1.2 smd: 1(-1.905,-2.909) 2(-0.635,-2.909) 3(0.635,-2.909) 4(1.905,-2.909) 5(1.905,2.909) 6(0.635,2.909) 7(-0.635,2.909) 8(-1.905,2.909)
  rect 3.3x2.4 smd: 9(0,0)
F0805
  rect 1.335x1.5 smd: 1(-1.143,0) 2(1.143,0)
IND-SMD_L4.4-W4.2
  rect 1.4x2.12 smd: 1(2.028,0) 2(-2.028,0)
LED0603-RD
  rect 0.8x0.8 smd: 1(-0.799,0) 2(0.799,0)
LED-TH_BD3.8-P2.54-FD_WHITE
  round 1.524 hole 0.9: 1(-1.27,0) 2(1.27,0)
Pad_e521
  round 1.3 smd far side: 1(0,0)
Pad_e522
  round 1.3 smd far side: 2(0,0)
Pad_e523
  round 1.3 smd far side: 3(0,0)
Pad_e524
  round 1.3 smd far side: 4(0,0)
Pad_e1058
  round 1.3 hole 0.78: 1(0,0)
Pad_e1060
  round 1.3 hole 0.78: 1(0,0)
Pad_e1061
  round 1.3 hole 0.78: 2(0,0)
Pad_e1062
  round 1.3 hole 0.78: 3(0,0)
Pad_e1063
  round 1.3 hole 0.78: 4(0,0)
R0603
  rect 0.806x0.864 smd: 1(-0.753,0) 2(0.753,0)
R0805
  rect 1.133x1.377 smd: 1(-1,0) 2(1,0)
R1206
  rect 1.208x1.701 smd: 1(-1.479,0) 2(1.479,0)
SOT-23-5_L2.9-W1.6-P0.95-LS2.8-BR
  rect 1x0.6 smd: 1(1.1,-0.95) 2(1.1,0) 3(1.1,0.95) 4(-1.1,0.95) 5(-1.1,-0.95)
SOT-23_L2.9-W1.3-P1.90-LS2.4-BR
  rect 1x0.8 smd: 1(1.15,-0.95) 2(1.15,0.95) 3(-1.15,0)
SW-TH_4P-L6.0-W6.0-P4.50-LS6.5
  round 1.8 hole 1.2: 1(-3.25,2.25) 2(3.25,2.25) 3(-3.25,-2.25) 4(3.25,-2.25)
TESTPOINT-TH_YZ134112062B-02
  round 1.3 hole 0.7: 1(0,0)
TSSOP-16_L5.0-W4.4-P0.65-LS6.4-BL-EP
  oval 0.35x1.3 smd: 1(-2.275,-2.85) 2(-1.625,-2.85) 3(-0.975,-2.85) 4(-0.325,-2.85) 5(0.325,-2.85) 6(0.975,-2.85) 7(1.625,-2.85) 8(2.275,-2.85) 9(2.275,2.85) 10(1.625,2.85) 11(0.975,2.85) 12(0.325,2.85) 13(-0.325,2.85) 14(-0.975,2.85) 15(-1.625,2.85) 16(-2.275,2.85)
  rect 2.74x2.74 smd: 17(0,0)
USB-C-SMD_TYPE-C-6PIN-2MD-073
  rect 0.55x1.1 smd: 1(-3.2,2.375) 2(-2.4,2.375) 11(2.4,2.375) 12(3.2,2.375)
  rect 0.3x1.1 smd: 3(-1.75,2.375) 4(-1.25,2.375) 5(-0.75,2.375) 6(-0.25,2.375) 7(0.25,2.375) 8(0.75,2.375) 9(1.25,2.375) 10(1.75,2.375)
  oval 1.1x2 hole 0.6x1.5: 13(-4.325,1.825) 14(4.325,1.825)
  oval 1.2x1.8 hole 0.6x1.2: 13(-4.325,-2.375) 14(4.325,-2.375)
VSON-10_L3.0-W3.0-P0.50-TL-EP
  rect 0.8x0.3 smd: 1(-1.5,1) 2(-1.5,0.5) 3(-1.5,0) 4(-1.5,-0.5) 5(-1.5,-1) 6(1.5,-1) 7(1.5,-0.5) 8(1.5,0) 9(1.5,0.5) 10(1.5,1)
  custom 1.52x3.42 smd: 11(0.002,-0.009)
WIRELM-SMD_ESP32-S3-WROOM-1
  rect 1.5x0.9 smd: 1(-8.75,8.895) 2(-8.75,7.625) 3(-8.75,6.355) 4(-8.75,5.085) 5(-8.75,3.815) 6(-8.75,2.545) 7(-8.75,1.275) 8(-8.75,0.005) 9(-8.75,-1.265) 10(-8.75,-2.535) 11(-8.75,-3.805) 12(-8.75,-5.075) 13(-8.75,-6.345) 14(-8.75,-7.615) 27(8.75,-7.615) 28(8.75,-6.345) 29(8.75,-5.075) 30(8.75,-3.805) 31(8.75,-2.535) 32(8.75,-1.265) 33(8.75,0.005) 34(8.75,1.275) 35(8.75,2.545) 36(8.75,3.815) 37(8.75,5.085) 38(8.75,6.355) 39(8.75,7.625) 40(8.75,8.895)
  rect 0.9x1.5 smd: 15(-6.985,-8.895) 16(-5.715,-8.895) 17(-4.445,-8.895) 18(-3.175,-8.895) 19(-1.905,-8.895) 20(-0.635,-8.895) 21(0.635,-8.895) 22(1.905,-8.895) 23(3.175,-8.895) 24(4.445,-8.895) 25(5.715,-8.895) 26(6.985,-8.865)
  rect 0.9x0.9 smd: 41(-2.9,2.575) 41(-2.9,1.175) 41(-2.9,-0.225) 41(-1.5,2.575) 41(-1.5,1.175) 41(-1.5,-0.225) 41(-0.1,2.575) 41(-0.1,1.175) 41(-0.1,-0.225)

## Nets
As in the schematic, except:
VCC: LED2.1 LED3.1 NOREF#3.1 U2.4 USB1.2 USB1.11
BAT-: C1.1 C3.2 C4.1 C5.1 C8.1 C9.2 C13.1 C14.2 C16.2 C17.1 CN1.2 LED4.1 NOREF#4.4 Q1.1 R15.1 R16.1 R17.1 R19.1 SW4.4 SW5.4 SW6.1 U1.1 U1.40 U1.41 U2.3 U3.9 U6.2 U7.3 U7.6 U7.13 U7.17 U11.1 USB1.1 USB1.12
LED: NOREF#8.3 R13.2 R14.2
VREG_3V3: C5.2 C17.2 NOREF#6.1 R21.1 R22.2 R23.2 R26.1 U1.2 U6.5
$1N10367: NOREF#9.1 U1.10
$1N10374: NOREF#7.2 U1.11
$1N10380: NOREF#2.3 U1.13

Pads without a net: NOREF 2; NOREF#5 4; SW4 2 3; SW5 2 3; SW6 2 3; U1 12 14 15 16 17 18 19 22 24 25 26 28 29 30 31 32 33 34 35 36 37 38 39; U2 1 6 7 8 9; U3 1 4 7 8 11; U6 3 4; U7 2 4 5 7 8; USB1 3 5 8 9 13 14

## Via types
v1: diameter 0.61, hole 0.305, Top Layer to Bottom Layer, 58 vias

## Routing (per net, layer and track width the routed paths; a pad name or vN(x,y) marks a point on that pad's centre or on a via; arc(x,y) is an arc through that point)
VCC: length 80.5
  Top Layer w0.254: 81.46,73.21 81.46,79.94 LED2.1 ; 81.46,73.21 81.71,72.95 v1(86.54,72.95) ; 81.46,73.21 81.46,60 88.7,52.76 ; USB1.11 7.11,49.13 6.66,49.13 6.5,49.3 6.5,53.33 6.66,53.49 7.11,53.49 USB1.2 25.93,53.71 32.11,59.89
  Bottom Layer w0.254: v1(86.54,72.95) NOREF#3.1
BAT+: length 71.7
  Top Layer w0.254: CN1.1 8.91,15.45 9.09,15.63 14.88,15.63 43.43,44.18 Q1.3
BAT-: length 437.2
  Top Layer w0.254: 28.71,61.22 28.89,61.04 ; 28.71,61.22 24.55,65.38 24.55,67 ; 28.71,61.22 28.71,62.36 ; 28.89,61.04 22.36,54.51 v1(14.42,54.51) USB1.1 ; 28.89,61.04 31.99,61.04 32.11,61.16 ; 44.38,63.98 v1(44.38,67.7) ; 44.38,63.98 44.42,64.01 v1(45.59,64.01) ; 44.38,63.98 44.38,47.11 ; 12.29,50.51 12.29,50.2 12.95,49.54 ; 12.29,50.51 11.31,49.54 ; 12.29,50.51 12.98,51.21 12.98,52.58 ; 18.76,92.81 5.87,92.81 5.09,92.04 ; 18.76,92.81 19.75,91.83 ; 18.76,92.81 26.4,92.81 26.94,93.36 ; 51.47,60.74 51.82,61.09 51.82,62.98 ; 51.47,60.74 51.13,60.41 50.13,60.41 ; 51.47,60.74 51.94,60.26 v1(51.94,60.2) ; 44.64,34.93 44.64,34.06 44.66,34.04 ; 44.64,34.93 48.64,34.93 U7.13 49.01,34.56 51.19,34.56 ; 44.64,34.93 37.3,34.93 36.99,35.24 ; NOREF#4.4 13.08,49.66 12.95,49.54 ; CN1.2 13.19,11.44 36.99,35.24 ; 54.54,36.03 52.66,36.03 52.19,35.56 ; 24.55,67 30.14,67 v1(33.05,69.91) ; 24.55,67 11.24,67 10.29,66.05 ; 12.95,49.54 12.95,49.28 11.79,48.11 USB1.12 ; 56.94,49.41 54.65,47.11 44.38,47.11 ; 56.94,49.41 C3.2 ; 56.94,49.41 v1(58.17,49.41) ; C4.1 49.24,42.8 50.83,42.8 ; 12.06,52.58 12.98,52.58 ; 12.98,52.58 v1(13.46,52.58) ; 52.07,67.03 52.67,66.43 53.86,66.43 54.04,66.25 54.04,65.02 R19.1 ; 52.07,67.03 52.07,63.3 51.82,63.04 51.82,62.98 ; 52.07,67.03 U3.9 ; 52.19,34.56 52.66,34.08 U7.3 ; LED4.1 5.37,91.76 5.09,92.04 ; 51.87,41.77 50.83,42.8 ; 51.87,41.77 50.72,40.62 42.37,40.62 ; 51.87,41.77 52.59,41.04 C5.1 ; 50.83,42.8 U6.2 ; 44.66,34.04 43.69,34.04 42.69,33.05 42.69,30.69 31.36,19.36 31.36,10.11 31.53,9.94 33.26,9.94 35.72,7.47 C13.1 36.48,4.56 U11.1 ; 44.66,34.04 C9.2 ; 39.25,37.5 40.69,38.94 ; 39.25,37.5 36.99,35.24 ; 39.25,37.5 39.27,37.5 40.65,36.12 ; 40.69,38.94 42.37,40.62 ; 40.69,38.94 41.39,38.94 C8.1 ; 44.38,47.11 44.38,42.63 42.37,40.62 ; 10.29,66.05 4.83,66.05 3.56,67.31 3.56,68.79 4.09,69.32 3.62,69.79 3.62,70.04 3.83,70.25 3.83,90.78 5.09,92.04 ; 10.29,66.05 12.03,64.3 SW5.4 ; 51.82,62.98 C1.1 ; v1(45.72,69.09) 49.56,69.09 52.9,72.43 SW4.4 ; v1(36.41,67.7) 36.41,69.79 SW6.1 ; U1.40 27.06,93.36
  Top Layer w1.27: 33.38,87.04 v1(32.79,87.04) v1(32.79,85.64) v1(32.79,84.23) v1(34.19,84.23) v1(35.59,84.23) v1(35.59,85.64) v1(35.59,87.04) ; 33.38,87.04 v1(34.19,87.04) v1(34.19,85.64) ; 33.38,87.04 30.99,89.42 30.99,90.35 28.01,93.32 27.09,93.32 27.06,93.36
  Bottom Layer w0.254: v1(45.59,64.01) 45.72,64.14 v1(45.72,69.09) ; v1(14.42,54.51) 14.42,53.54 v1(13.46,52.58) ; v1(51.94,60.2) 58.17,53.98 v1(58.17,49.41) ; v1(44.38,67.7) 43.26,66.58 37.53,66.58 v1(36.41,67.7) 35.93,67.7 33.72,69.91 v1(33.05,69.91)
BAT_PROTECTED: length 46.1
  Top Layer w0.254: 46.45,64.86 47.12,65.53 U3.5 ; 46.45,64.86 C1.2 ; 46.45,64.86 46.45,62.68 ; 46.45,64.86 45.06,66.25 45.06,68.32 44.9,68.48 43.87,68.48 43.71,68.32 43.71,67.8 43.61,67.7 Q1.2 40.64,65.86 40.64,60.07 40.46,59.89 U2.5 ; 46.45,62.68 46.45,60.1 47.75,58.81 51.69,58.81 53.34,60.46 53.34,64.9 v1(52.71,65.54) ; 46.45,62.68 48.73,60.41 ; U3.6 51.35,65.53 v1(51.36,65.54)
  Bottom Layer w0.254: v1(52.71,65.54) v1(51.36,65.54)
EXTRA_GPIO: length 3.3
  Top Layer w0.254: U13.1 40.57,3.45 39.88,4.15
LED: length 20.8
  Top Layer w0.254: R13.2 89.59,77.23 v1(89.59,68.89) 89.59,62.3 R14.2
  Bottom Layer w0.254: 89.59,68.89 NOREF#8.3
LED_CTRL: length 93.9
  Top Layer w0.254: v1(37.47,21.85) 37.97,21.34 37.97,5.74 ; 26.94,88.28 26.4,87.73 26.07,87.73 21.59,83.25 v1(21.59,73.12)
  Bottom Layer w0.254: v1(37.47,21.85) 19.61,39.7 19.61,72.13 19.95,72.47 20.94,72.47 v1(21.59,73.12)
POGO_VCC: length 8.3
  Top Layer w0.254: U8.1 34.44,3.41 C13.2 32.54,8.46 F1.2
VREG_3V3: length 161.1
  Top Layer w0.254: 42.78,70.46 44.19,70.46 v1(46.87,73.15) ; 30.57,69.91 24.71,69.91 23.36,71.26 v1(14.03,71.26) 10.17,71.26 ; 30.57,69.91 31.21,70.54 33.67,70.54 33.83,70.38 33.83,69.45 33.67,69.29 32.93,69.29 29.53,65.89 29.53,61.81 29.7,61.65 30.57,61.65 30.65,61.58 31.23,61.58 31.4,61.74 32.83,61.74 32.99,61.58 32.99,54.84 27.43,49.28 NOREF#6.1 ; 30.57,69.91 v1(32.08,69.91) ; 26.94,92.09 26.76,92.26 23.55,92.26 23.37,92.08 ; 23.37,92.08 23.11,91.83 21.15,91.83 20.42,91.1 19.23,91.1 18.86,91.47 17.76,91.47 17.43,91.8 15.67,91.8 ; 23.37,92.08 v1(23.37,91.45) ; U6.5 56.03,43.75 ; 56.03,43.75 C5.2 ; 56.03,43.75 57.57,43.75 57.75,43.93 v1(57.75,44.34)
  Bottom Layer w0.254: v1(14.03,71.26) 16.64,73.87 16.64,84.71 v1(23.37,91.45) ; v1(46.87,73.15) 44.49,70.77 32.62,70.77 32.08,70.23 v1(32.08,69.91) 32.08,69.4 32.66,68.82 32.66,67.37 33.35,66.68 34.8,66.68 45.48,56 45.48,49.95 52.25,43.17 53.24,43.17 53.59,43.51 53.59,44.02 53.77,44.2 57.11,44.2 57.25,44.34 v1(57.75,44.34)
VREG_5V: length 113.4
  Top Layer w0.254: 42.05,36.12 42.58,35.59 43.94,35.59 ; v1(48.77,49.66) 49.39,50.28 ; 49.39,50.28 50.26,49.41 ; 49.39,50.28 49.91,50.81 U5.1 ; U7.12 48.23,35.38 48.02,35.59 v1(47.4,35.59) 43.94,35.59 ; v1(46.3,68.51) 46.3,67.91 47.12,67.1 47.56,67.1 U3.2 ; 58.73,67.57 58.73,57.88 50.26,49.41 ; v1(44.77,32.26) 32.39,19.89 F1.1 ; C8.2 44.05,38.48 C18.2 43.94,36.82 43.94,35.59 ; v1(53,43.75) 52.58,44.18 C4.2 46.86,42.42 v1(46.86,41.28) ; 50.26,49.41 C3.1
  Bottom Layer w0.254: v1(46.3,68.51) 46.18,68.38 46.18,56.31 46.34,56.15 46.34,52.09 48.23,50.2 ; v1(44.77,32.26) 47.4,34.89 v1(47.4,35.59) 47.4,40.75 v1(46.86,41.28) ; 48.23,50.2 48.23,48.53 v1(53,43.75) ; 48.23,50.2 v1(48.77,49.66)
$1N1798: length 3.2
  Top Layer w0.254: 10.55,52.58 7.35,52.58 USB1.4
$1N1835: length 2.5
  Top Layer w0.254: 9.81,49.54 9.78,49.56 USB1.10
$1N1974: length 38.5
  Top Layer w0.254: v1(12.31,55.11) v1(22.45,65.26) ; USB1.6 8.5,51.56 v1(8.76,51.82) ; v1(35.05,74.17) U1.20
  Bottom Layer w0.254: v1(8.76,51.82) 12.05,55.11 v1(12.31,55.11) ; v1(22.45,65.26) 31.37,74.17 v1(35.05,74.17)
$1N1982: length 41.4
  Top Layer w0.254: v1(8.76,50.9) 8.67,50.98 8.52,50.98 8.44,51.06 USB1.7 ; v1(36.29,74.17) 36.29,75.54 U1.21 ; v1(25.53,63.41) v1(17.35,55.23)
  Bottom Layer w0.254: v1(17.35,55.23) 13.01,50.9 v1(8.76,50.9) ; v1(25.53,63.41) 26.03,63.41 31.5,68.87 31.5,70.15 32.47,71.12 34.27,71.12 35.01,71.87 35.01,72.39 36.29,73.67 v1(36.29,74.17)
$1N2206: length 13.1
  Top Layer w0.254: v1(49.91,57.16) U5.2 ; U3.3 47.63,66.53 v1(46.86,66.53)
  Bottom Layer w0.254: v1(49.91,57.16) 46.86,60.21 v1(46.86,66.53)
$1N2258: length 9.7
  Top Layer w0.254: U3.10 54.92,67.53 ; 54.92,67.53 54.92,67.09 R19.2 ; 54.92,67.53 57.12,67.53 R18.1
$1N6197: length 99.4
  Top Layer w0.254: U7.16 v1(48.84,32.27)
  Bottom Layer w0.254: 26.92,87 26.6,86.67 19.61,86.67 19.43,86.49 19.43,72.45 19.25,72.28 19.25,39.23 37.22,21.27 37.71,21.27 38.05,21.61 38.05,21.71 38.37,22.03 38.85,22.03 43.83,27.01 43.83,30.77 44.38,31.32 45.16,31.32 46.11,32.27 v1(48.84,32.27)
  vias: v1(26.94,87.01)
$1N6260: length 73.1
  Top Layer w0.254: 26.94,85.73 27.26,85.73 27.97,85.03 27.97,76.28 26.94,75.25 26.94,73.78 v1(29.72,71)
  Bottom Layer w0.254: v1(48.84,33.43) 46.76,33.43 45.01,31.68 44.53,31.68 44.19,32.02 44.19,32.51 44.53,32.85 44.85,32.85 45.86,33.85 45.86,42.25 24.94,63.17 24.94,63.65 25.28,63.99 25.61,63.99 29.72,68.1 v1(29.72,71)
$1N6266: length 71.2
  Bottom Layer w0.254: v1(48.84,37.33) 49.77,38.26 51.84,38.26 57.33,43.75 58,43.75 58.34,44.1 58.34,44.58 57.51,45.41 57.51,50.38 48.84,59.05 48.84,72 47.11,73.73 37.67,73.73 v1(26.94,84.47)
$1N6369: length 2.3
  Top Layer w0.254: R20.2 53,31.23 53,31.25 U7.1
$1N6643: length 9.1
  Top Layer w0.254: 47.32,34.08 U7.14 49.31,34.08 49.77,33.62 49.77,32.41 50.94,31.25 ; 47.32,34.08 47.32,33.84 C15.1 ; 47.32,34.08 46.21,34.08 C9.1
$1N6818: length 3.2
  Top Layer w0.254: C18.1 47.48,36.93 48.18,36.23 48.64,36.23 48.84,36.03
$1N8016: length 3.3
  Top Layer w0.254: 37.97,4.24 38.52,3.68 U12.1
$1N8077: length 99.4
  Top Layer w0.254: 39.88,5.66 39.88,21.34 v1(38.61,22.61) ; 26.94,89.55 26.4,89 26.07,89 21.01,83.94 21.01,72.88 21.35,72.53 23.99,72.53 v1(25.78,70.74)
  Bottom Layer w0.254: v1(25.78,70.74) 21.51,66.48 21.51,63.33 38.61,46.23 v1(38.61,22.61)
$1N8579: length 51.1
  Top Layer w0.254: 4.19,71.37 4.29,71.26 8.67,71.26 ; 4.19,71.37 4.19,90.09 4.37,90.27 26.4,90.27 26.94,90.81 ; 4.19,71.37 4.19,70.45 5.84,68.8 SW5.1
$1N8766: length 8.8
  Top Layer w0.254: 46.89,76.77 44.51,76.77 U1.27 ; 46.89,76.77 51.09,76.77 ; 46.89,76.77 46.87,76.75 46.87,74.69
$1N8940: length 61.2
  Top Layer w0.254: U7.10 48.66,36.68 48.47,36.88 48.18,36.88 47.91,37.14 47.91,37.18 v1(45.27,39.82)
  Bottom Layer w0.254: v1(26.94,83.2) 25.67,81.93 25.67,71.68 26.36,70.98 26.36,70.5 21.87,66.01 21.87,63.48 38.96,46.38 38.96,45.24 44.38,39.82 v1(45.27,39.82)
$1N9011: length 10.8
  Top Layer w0.254: 41.27,70.46 41.22,70.52 38.86,70.52 ; SW6.4 38.86,69.33 38.86,70.52 ; 38.86,70.52 U1.23
$1N9325: length 2.7
  Top Layer w0.254: 11.01,91.83 11.03,91.8 13.67,91.8
$1N10111: length 4.8
  Top Layer w0.254: R13.1 88.7,80.38 LED2.2
$1N10115: length 4.1
  Top Layer w0.254: LED3.2 87.81,56.19 R14.1
$1N10367: length 39.8
  Top Layer w0.254: 26.94,81.93 26.81,81.79 v1(24.64,81.79)
  Bottom Layer w0.254: v1(24.64,81.79) 24.64,70.1 21.16,66.62 21.16,58.1 28.32,50.93 NOREF#9.1
$1N10374: length 43.1
  Top Layer w0.254: 26.94,80.66 26.69,80.9 v1(24.05,80.9)
  Bottom Layer w0.254: NOREF#7.2 31.88,50.93 30.61,49.66 30.42,49.66 29.91,49.15 29.6,49.15 20.8,57.95 20.8,58.2 20.57,58.43 20.57,58.68 20.8,58.91 20.8,66.77 24.05,70.02 v1(24.05,80.9)
$1N10380: length 42.6
  Top Layer w0.254: 26.94,78.12 26.81,78.24 v1(23.11,78.24)
  Bottom Layer w0.254: v1(23.11,78.24) 23.11,69.59 20.45,66.92 20.45,59.05 20.22,58.83 20.22,57.71 29.2,48.72 31.25,48.72 32.19,49.66 NOREF#2.3
$1N10576: length 1.9
  Top Layer w0.254: 32.11,62.43 32.04,62.36 30.22,62.36
